# Altium schematic sheet POGO_Tester_Rev1_Connectors.SchDoc
size OrCAD B; SheetNumber: 2; SheetTotal: 2
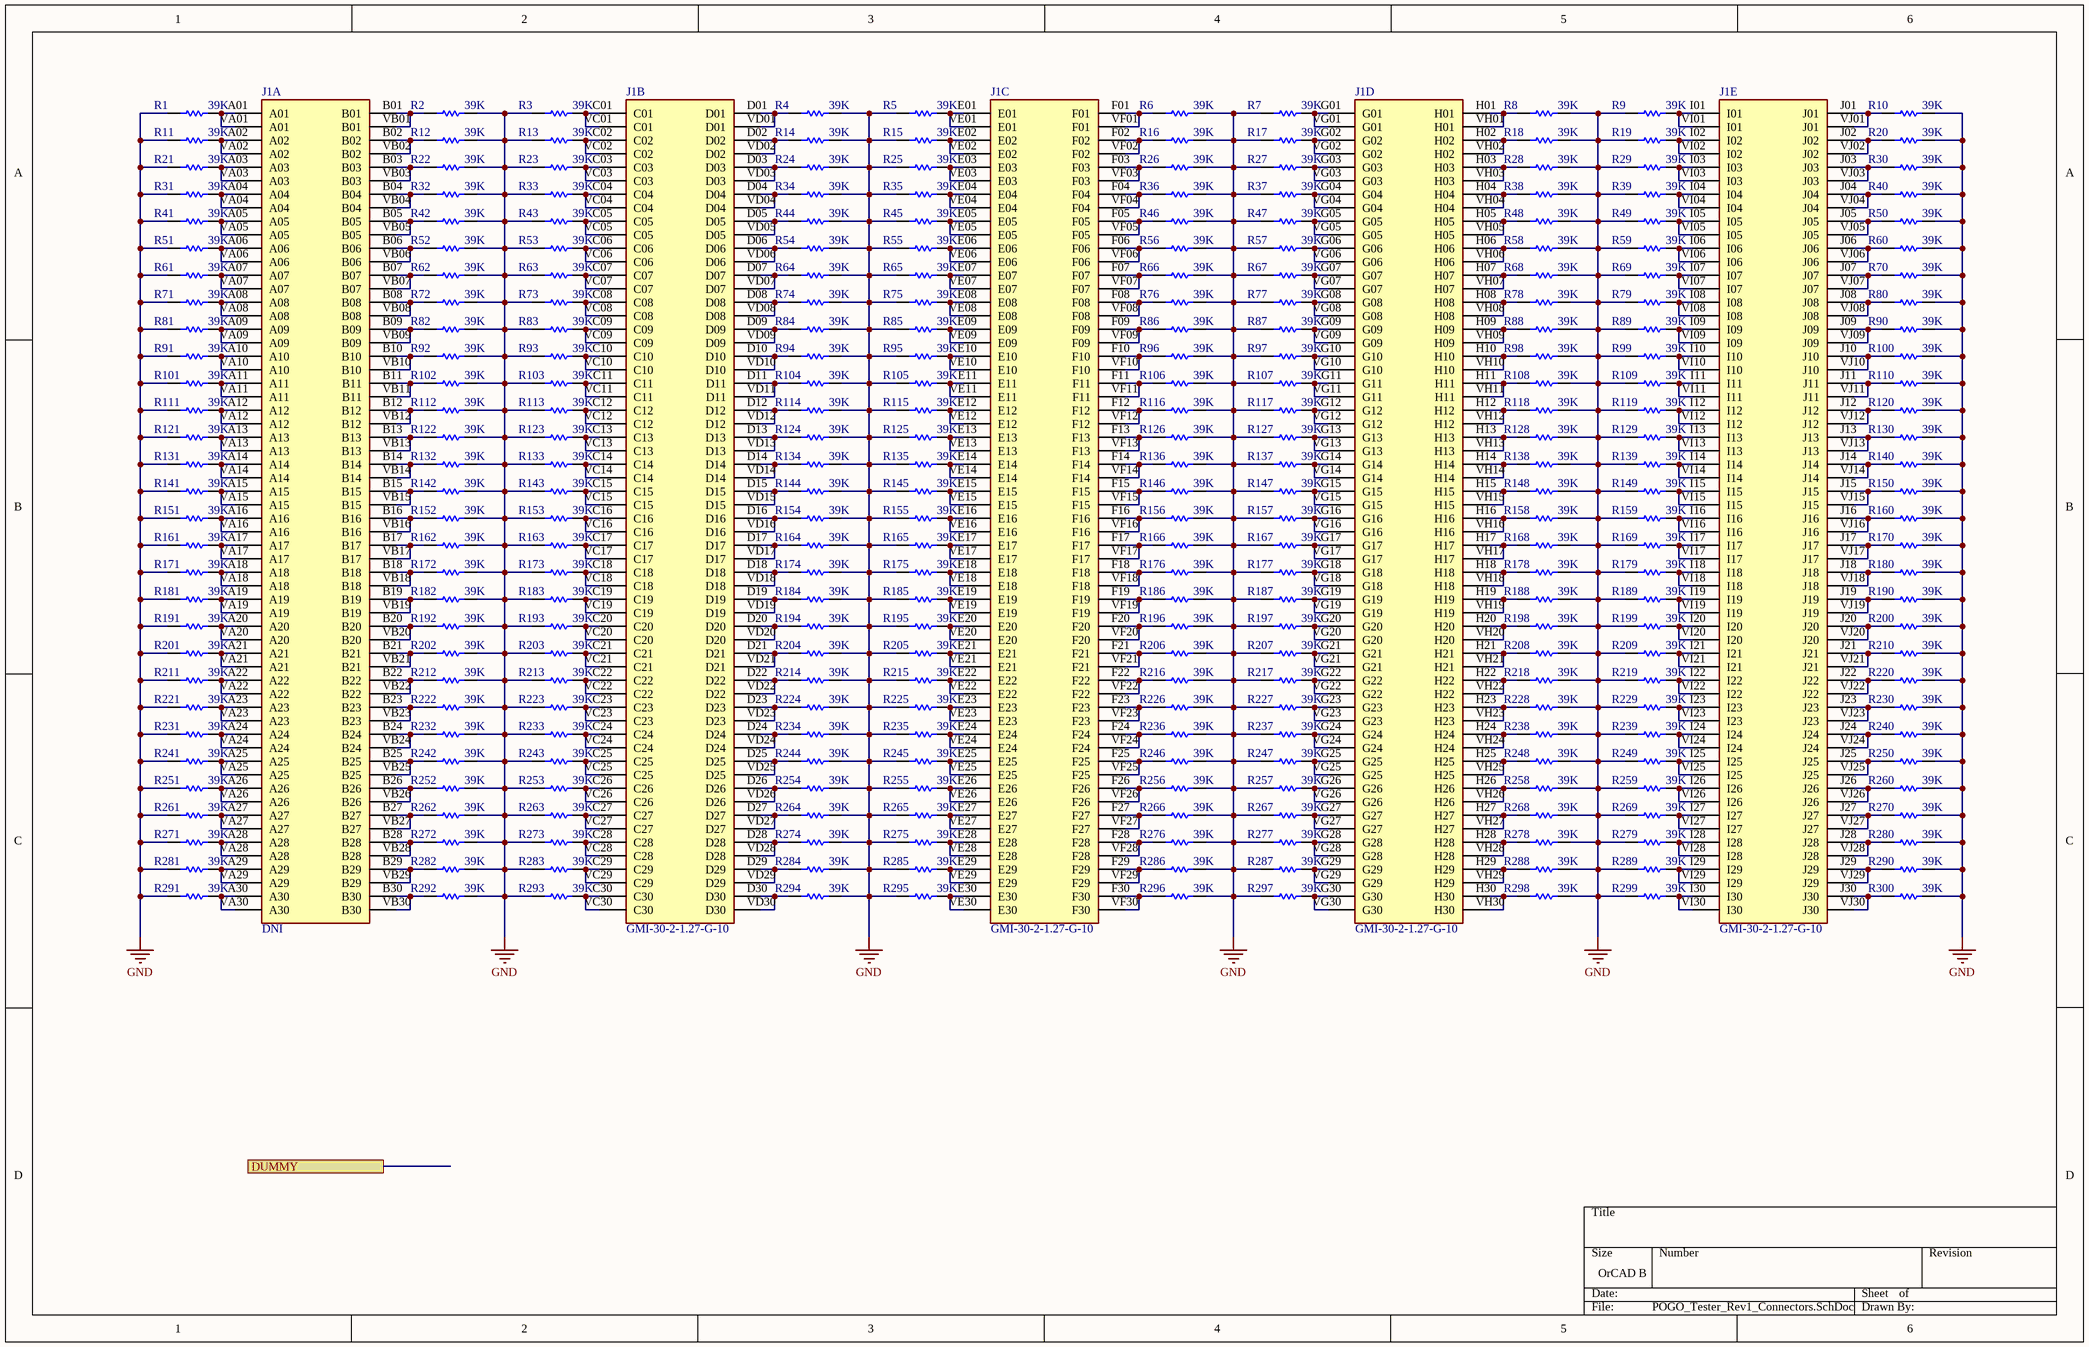
[diagram p0: POGO_Tester_Rev1_Connectors.SchDoc]

## Parts
J1  DNI  [SAMTEC_GMI-30-2-1.27-G-10 - Nothing But Pads]  (parts A,B,C,D,E of 5)
R1  value 39K  [DEFAULT_RESISTOR_0402]  (hidden comment: RCS040239K0FKED)
R2  value 39K  [DEFAULT_RESISTOR_0402]  (hidden comment: RCS040239K0FKED)
R3  value 39K  [DEFAULT_RESISTOR_0402]  (hidden comment: RCS040239K0FKED)
R4  value 39K  [DEFAULT_RESISTOR_0402]  (hidden comment: RCS040239K0FKED)
R5  value 39K  [DEFAULT_RESISTOR_0402]  (hidden comment: RCS040239K0FKED)
R6  value 39K  [DEFAULT_RESISTOR_0402]  (hidden comment: RCS040239K0FKED)
R7  value 39K  [DEFAULT_RESISTOR_0402]  (hidden comment: RCS040239K0FKED)
R8  value 39K  [DEFAULT_RESISTOR_0402]  (hidden comment: RCS040239K0FKED)
R9  value 39K  [DEFAULT_RESISTOR_0402]  (hidden comment: RCS040239K0FKED)
R10  value 39K  [DEFAULT_RESISTOR_0402]  (hidden comment: RCS040239K0FKED)
R11  value 39K  [DEFAULT_RESISTOR_0402]  (hidden comment: RCS040239K0FKED)
R12  value 39K  [DEFAULT_RESISTOR_0402]  (hidden comment: RCS040239K0FKED)
R13  value 39K  [DEFAULT_RESISTOR_0402]  (hidden comment: RCS040239K0FKED)
R14  value 39K  [DEFAULT_RESISTOR_0402]  (hidden comment: RCS040239K0FKED)
R15  value 39K  [DEFAULT_RESISTOR_0402]  (hidden comment: RCS040239K0FKED)
R16  value 39K  [DEFAULT_RESISTOR_0402]  (hidden comment: RCS040239K0FKED)
R17  value 39K  [DEFAULT_RESISTOR_0402]  (hidden comment: RCS040239K0FKED)
R18  value 39K  [DEFAULT_RESISTOR_0402]  (hidden comment: RCS040239K0FKED)
R19  value 39K  [DEFAULT_RESISTOR_0402]  (hidden comment: RCS040239K0FKED)
R20  value 39K  [DEFAULT_RESISTOR_0402]  (hidden comment: RCS040239K0FKED)
R21  value 39K  [DEFAULT_RESISTOR_0402]  (hidden comment: RCS040239K0FKED)
R22  value 39K  [DEFAULT_RESISTOR_0402]  (hidden comment: RCS040239K0FKED)
R23  value 39K  [DEFAULT_RESISTOR_0402]  (hidden comment: RCS040239K0FKED)
R24  value 39K  [DEFAULT_RESISTOR_0402]  (hidden comment: RCS040239K0FKED)
R25  value 39K  [DEFAULT_RESISTOR_0402]  (hidden comment: RCS040239K0FKED)
R26  value 39K  [DEFAULT_RESISTOR_0402]  (hidden comment: RCS040239K0FKED)
R27  value 39K  [DEFAULT_RESISTOR_0402]  (hidden comment: RCS040239K0FKED)
R28  value 39K  [DEFAULT_RESISTOR_0402]  (hidden comment: RCS040239K0FKED)
R29  value 39K  [DEFAULT_RESISTOR_0402]  (hidden comment: RCS040239K0FKED)
R30  value 39K  [DEFAULT_RESISTOR_0402]  (hidden comment: RCS040239K0FKED)
R31  value 39K  [DEFAULT_RESISTOR_0402]  (hidden comment: RCS040239K0FKED)
R32  value 39K  [DEFAULT_RESISTOR_0402]  (hidden comment: RCS040239K0FKED)
R33  value 39K  [DEFAULT_RESISTOR_0402]  (hidden comment: RCS040239K0FKED)
R34  value 39K  [DEFAULT_RESISTOR_0402]  (hidden comment: RCS040239K0FKED)
R35  value 39K  [DEFAULT_RESISTOR_0402]  (hidden comment: RCS040239K0FKED)
R36  value 39K  [DEFAULT_RESISTOR_0402]  (hidden comment: RCS040239K0FKED)
R37  value 39K  [DEFAULT_RESISTOR_0402]  (hidden comment: RCS040239K0FKED)
R38  value 39K  [DEFAULT_RESISTOR_0402]  (hidden comment: RCS040239K0FKED)
R39  value 39K  [DEFAULT_RESISTOR_0402]  (hidden comment: RCS040239K0FKED)
R40  value 39K  [DEFAULT_RESISTOR_0402]  (hidden comment: RCS040239K0FKED)
R41  value 39K  [DEFAULT_RESISTOR_0402]  (hidden comment: RCS040239K0FKED)
R42  value 39K  [DEFAULT_RESISTOR_0402]  (hidden comment: RCS040239K0FKED)
R43  value 39K  [DEFAULT_RESISTOR_0402]  (hidden comment: RCS040239K0FKED)
R44  value 39K  [DEFAULT_RESISTOR_0402]  (hidden comment: RCS040239K0FKED)
R45  value 39K  [DEFAULT_RESISTOR_0402]  (hidden comment: RCS040239K0FKED)
R46  value 39K  [DEFAULT_RESISTOR_0402]  (hidden comment: RCS040239K0FKED)
R47  value 39K  [DEFAULT_RESISTOR_0402]  (hidden comment: RCS040239K0FKED)
R48  value 39K  [DEFAULT_RESISTOR_0402]  (hidden comment: RCS040239K0FKED)
R49  value 39K  [DEFAULT_RESISTOR_0402]  (hidden comment: RCS040239K0FKED)
R50  value 39K  [DEFAULT_RESISTOR_0402]  (hidden comment: RCS040239K0FKED)
R51  value 39K  [DEFAULT_RESISTOR_0402]  (hidden comment: RCS040239K0FKED)
R52  value 39K  [DEFAULT_RESISTOR_0402]  (hidden comment: RCS040239K0FKED)
R53  value 39K  [DEFAULT_RESISTOR_0402]  (hidden comment: RCS040239K0FKED)
R54  value 39K  [DEFAULT_RESISTOR_0402]  (hidden comment: RCS040239K0FKED)
R55  value 39K  [DEFAULT_RESISTOR_0402]  (hidden comment: RCS040239K0FKED)
R56  value 39K  [DEFAULT_RESISTOR_0402]  (hidden comment: RCS040239K0FKED)
R57  value 39K  [DEFAULT_RESISTOR_0402]  (hidden comment: RCS040239K0FKED)
R58  value 39K  [DEFAULT_RESISTOR_0402]  (hidden comment: RCS040239K0FKED)
R59  value 39K  [DEFAULT_RESISTOR_0402]  (hidden comment: RCS040239K0FKED)
R60  value 39K  [DEFAULT_RESISTOR_0402]  (hidden comment: RCS040239K0FKED)
R61  value 39K  [DEFAULT_RESISTOR_0402]  (hidden comment: RCS040239K0FKED)
R62  value 39K  [DEFAULT_RESISTOR_0402]  (hidden comment: RCS040239K0FKED)
R63  value 39K  [DEFAULT_RESISTOR_0402]  (hidden comment: RCS040239K0FKED)
R64  value 39K  [DEFAULT_RESISTOR_0402]  (hidden comment: RCS040239K0FKED)
R65  value 39K  [DEFAULT_RESISTOR_0402]  (hidden comment: RCS040239K0FKED)
R66  value 39K  [DEFAULT_RESISTOR_0402]  (hidden comment: RCS040239K0FKED)
R67  value 39K  [DEFAULT_RESISTOR_0402]  (hidden comment: RCS040239K0FKED)
R68  value 39K  [DEFAULT_RESISTOR_0402]  (hidden comment: RCS040239K0FKED)
R69  value 39K  [DEFAULT_RESISTOR_0402]  (hidden comment: RCS040239K0FKED)
R70  value 39K  [DEFAULT_RESISTOR_0402]  (hidden comment: RCS040239K0FKED)
R71  value 39K  [DEFAULT_RESISTOR_0402]  (hidden comment: RCS040239K0FKED)
R72  value 39K  [DEFAULT_RESISTOR_0402]  (hidden comment: RCS040239K0FKED)
R73  value 39K  [DEFAULT_RESISTOR_0402]  (hidden comment: RCS040239K0FKED)
R74  value 39K  [DEFAULT_RESISTOR_0402]  (hidden comment: RCS040239K0FKED)
R75  value 39K  [DEFAULT_RESISTOR_0402]  (hidden comment: RCS040239K0FKED)
R76  value 39K  [DEFAULT_RESISTOR_0402]  (hidden comment: RCS040239K0FKED)
R77  value 39K  [DEFAULT_RESISTOR_0402]  (hidden comment: RCS040239K0FKED)
R78  value 39K  [DEFAULT_RESISTOR_0402]  (hidden comment: RCS040239K0FKED)
R79  value 39K  [DEFAULT_RESISTOR_0402]  (hidden comment: RCS040239K0FKED)
R80  value 39K  [DEFAULT_RESISTOR_0402]  (hidden comment: RCS040239K0FKED)
R81  value 39K  [DEFAULT_RESISTOR_0402]  (hidden comment: RCS040239K0FKED)
R82  value 39K  [DEFAULT_RESISTOR_0402]  (hidden comment: RCS040239K0FKED)
R83  value 39K  [DEFAULT_RESISTOR_0402]  (hidden comment: RCS040239K0FKED)
R84  value 39K  [DEFAULT_RESISTOR_0402]  (hidden comment: RCS040239K0FKED)
R85  value 39K  [DEFAULT_RESISTOR_0402]  (hidden comment: RCS040239K0FKED)
R86  value 39K  [DEFAULT_RESISTOR_0402]  (hidden comment: RCS040239K0FKED)
R87  value 39K  [DEFAULT_RESISTOR_0402]  (hidden comment: RCS040239K0FKED)
R88  value 39K  [DEFAULT_RESISTOR_0402]  (hidden comment: RCS040239K0FKED)
R89  value 39K  [DEFAULT_RESISTOR_0402]  (hidden comment: RCS040239K0FKED)
R90  value 39K  [DEFAULT_RESISTOR_0402]  (hidden comment: RCS040239K0FKED)
R91  value 39K  [DEFAULT_RESISTOR_0402]  (hidden comment: RCS040239K0FKED)
R92  value 39K  [DEFAULT_RESISTOR_0402]  (hidden comment: RCS040239K0FKED)
R93  value 39K  [DEFAULT_RESISTOR_0402]  (hidden comment: RCS040239K0FKED)
R94  value 39K  [DEFAULT_RESISTOR_0402]  (hidden comment: RCS040239K0FKED)
R95  value 39K  [DEFAULT_RESISTOR_0402]  (hidden comment: RCS040239K0FKED)
R96  value 39K  [DEFAULT_RESISTOR_0402]  (hidden comment: RCS040239K0FKED)
R97  value 39K  [DEFAULT_RESISTOR_0402]  (hidden comment: RCS040239K0FKED)
R98  value 39K  [DEFAULT_RESISTOR_0402]  (hidden comment: RCS040239K0FKED)
R99  value 39K  [DEFAULT_RESISTOR_0402]  (hidden comment: RCS040239K0FKED)
R100  value 39K  [DEFAULT_RESISTOR_0402]  (hidden comment: RCS040239K0FKED)
R101  value 39K  [DEFAULT_RESISTOR_0402]  (hidden comment: RCS040239K0FKED)
R102  value 39K  [DEFAULT_RESISTOR_0402]  (hidden comment: RCS040239K0FKED)
R103  value 39K  [DEFAULT_RESISTOR_0402]  (hidden comment: RCS040239K0FKED)
R104  value 39K  [DEFAULT_RESISTOR_0402]  (hidden comment: RCS040239K0FKED)
R105  value 39K  [DEFAULT_RESISTOR_0402]  (hidden comment: RCS040239K0FKED)
R106  value 39K  [DEFAULT_RESISTOR_0402]  (hidden comment: RCS040239K0FKED)
R107  value 39K  [DEFAULT_RESISTOR_0402]  (hidden comment: RCS040239K0FKED)
R108  value 39K  [DEFAULT_RESISTOR_0402]  (hidden comment: RCS040239K0FKED)
R109  value 39K  [DEFAULT_RESISTOR_0402]  (hidden comment: RCS040239K0FKED)
R110  value 39K  [DEFAULT_RESISTOR_0402]  (hidden comment: RCS040239K0FKED)
R111  value 39K  [DEFAULT_RESISTOR_0402]  (hidden comment: RCS040239K0FKED)
R112  value 39K  [DEFAULT_RESISTOR_0402]  (hidden comment: RCS040239K0FKED)
R113  value 39K  [DEFAULT_RESISTOR_0402]  (hidden comment: RCS040239K0FKED)
R114  value 39K  [DEFAULT_RESISTOR_0402]  (hidden comment: RCS040239K0FKED)
R115  value 39K  [DEFAULT_RESISTOR_0402]  (hidden comment: RCS040239K0FKED)
R116  value 39K  [DEFAULT_RESISTOR_0402]  (hidden comment: RCS040239K0FKED)
R117  value 39K  [DEFAULT_RESISTOR_0402]  (hidden comment: RCS040239K0FKED)
R118  value 39K  [DEFAULT_RESISTOR_0402]  (hidden comment: RCS040239K0FKED)
R119  value 39K  [DEFAULT_RESISTOR_0402]  (hidden comment: RCS040239K0FKED)
R120  value 39K  [DEFAULT_RESISTOR_0402]  (hidden comment: RCS040239K0FKED)
R121  value 39K  [DEFAULT_RESISTOR_0402]  (hidden comment: RCS040239K0FKED)
R122  value 39K  [DEFAULT_RESISTOR_0402]  (hidden comment: RCS040239K0FKED)
R123  value 39K  [DEFAULT_RESISTOR_0402]  (hidden comment: RCS040239K0FKED)
R124  value 39K  [DEFAULT_RESISTOR_0402]  (hidden comment: RCS040239K0FKED)
R125  value 39K  [DEFAULT_RESISTOR_0402]  (hidden comment: RCS040239K0FKED)
R126  value 39K  [DEFAULT_RESISTOR_0402]  (hidden comment: RCS040239K0FKED)
R127  value 39K  [DEFAULT_RESISTOR_0402]  (hidden comment: RCS040239K0FKED)
R128  value 39K  [DEFAULT_RESISTOR_0402]  (hidden comment: RCS040239K0FKED)
R129  value 39K  [DEFAULT_RESISTOR_0402]  (hidden comment: RCS040239K0FKED)
R130  value 39K  [DEFAULT_RESISTOR_0402]  (hidden comment: RCS040239K0FKED)
R131  value 39K  [DEFAULT_RESISTOR_0402]  (hidden comment: RCS040239K0FKED)
R132  value 39K  [DEFAULT_RESISTOR_0402]  (hidden comment: RCS040239K0FKED)
R133  value 39K  [DEFAULT_RESISTOR_0402]  (hidden comment: RCS040239K0FKED)
R134  value 39K  [DEFAULT_RESISTOR_0402]  (hidden comment: RCS040239K0FKED)
R135  value 39K  [DEFAULT_RESISTOR_0402]  (hidden comment: RCS040239K0FKED)
R136  value 39K  [DEFAULT_RESISTOR_0402]  (hidden comment: RCS040239K0FKED)
R137  value 39K  [DEFAULT_RESISTOR_0402]  (hidden comment: RCS040239K0FKED)
R138  value 39K  [DEFAULT_RESISTOR_0402]  (hidden comment: RCS040239K0FKED)
R139  value 39K  [DEFAULT_RESISTOR_0402]  (hidden comment: RCS040239K0FKED)
R140  value 39K  [DEFAULT_RESISTOR_0402]  (hidden comment: RCS040239K0FKED)
R141  value 39K  [DEFAULT_RESISTOR_0402]  (hidden comment: RCS040239K0FKED)
R142  value 39K  [DEFAULT_RESISTOR_0402]  (hidden comment: RCS040239K0FKED)
R143  value 39K  [DEFAULT_RESISTOR_0402]  (hidden comment: RCS040239K0FKED)
R144  value 39K  [DEFAULT_RESISTOR_0402]  (hidden comment: RCS040239K0FKED)
R145  value 39K  [DEFAULT_RESISTOR_0402]  (hidden comment: RCS040239K0FKED)
R146  value 39K  [DEFAULT_RESISTOR_0402]  (hidden comment: RCS040239K0FKED)
R147  value 39K  [DEFAULT_RESISTOR_0402]  (hidden comment: RCS040239K0FKED)
R148  value 39K  [DEFAULT_RESISTOR_0402]  (hidden comment: RCS040239K0FKED)
R149  value 39K  [DEFAULT_RESISTOR_0402]  (hidden comment: RCS040239K0FKED)
R150  value 39K  [DEFAULT_RESISTOR_0402]  (hidden comment: RCS040239K0FKED)
R151  value 39K  [DEFAULT_RESISTOR_0402]  (hidden comment: RCS040239K0FKED)
R152  value 39K  [DEFAULT_RESISTOR_0402]  (hidden comment: RCS040239K0FKED)
R153  value 39K  [DEFAULT_RESISTOR_0402]  (hidden comment: RCS040239K0FKED)
R154  value 39K  [DEFAULT_RESISTOR_0402]  (hidden comment: RCS040239K0FKED)
R155  value 39K  [DEFAULT_RESISTOR_0402]  (hidden comment: RCS040239K0FKED)
R156  value 39K  [DEFAULT_RESISTOR_0402]  (hidden comment: RCS040239K0FKED)
R157  value 39K  [DEFAULT_RESISTOR_0402]  (hidden comment: RCS040239K0FKED)
R158  value 39K  [DEFAULT_RESISTOR_0402]  (hidden comment: RCS040239K0FKED)
R159  value 39K  [DEFAULT_RESISTOR_0402]  (hidden comment: RCS040239K0FKED)
R160  value 39K  [DEFAULT_RESISTOR_0402]  (hidden comment: RCS040239K0FKED)
R161  value 39K  [DEFAULT_RESISTOR_0402]  (hidden comment: RCS040239K0FKED)
R162  value 39K  [DEFAULT_RESISTOR_0402]  (hidden comment: RCS040239K0FKED)
R163  value 39K  [DEFAULT_RESISTOR_0402]  (hidden comment: RCS040239K0FKED)
R164  value 39K  [DEFAULT_RESISTOR_0402]  (hidden comment: RCS040239K0FKED)
R165  value 39K  [DEFAULT_RESISTOR_0402]  (hidden comment: RCS040239K0FKED)
R166  value 39K  [DEFAULT_RESISTOR_0402]  (hidden comment: RCS040239K0FKED)
R167  value 39K  [DEFAULT_RESISTOR_0402]  (hidden comment: RCS040239K0FKED)
R168  value 39K  [DEFAULT_RESISTOR_0402]  (hidden comment: RCS040239K0FKED)
R169  value 39K  [DEFAULT_RESISTOR_0402]  (hidden comment: RCS040239K0FKED)
R170  value 39K  [DEFAULT_RESISTOR_0402]  (hidden comment: RCS040239K0FKED)
R171  value 39K  [DEFAULT_RESISTOR_0402]  (hidden comment: RCS040239K0FKED)
R172  value 39K  [DEFAULT_RESISTOR_0402]  (hidden comment: RCS040239K0FKED)
R173  value 39K  [DEFAULT_RESISTOR_0402]  (hidden comment: RCS040239K0FKED)
R174  value 39K  [DEFAULT_RESISTOR_0402]  (hidden comment: RCS040239K0FKED)
R175  value 39K  [DEFAULT_RESISTOR_0402]  (hidden comment: RCS040239K0FKED)
R176  value 39K  [DEFAULT_RESISTOR_0402]  (hidden comment: RCS040239K0FKED)
R177  value 39K  [DEFAULT_RESISTOR_0402]  (hidden comment: RCS040239K0FKED)
R178  value 39K  [DEFAULT_RESISTOR_0402]  (hidden comment: RCS040239K0FKED)
R179  value 39K  [DEFAULT_RESISTOR_0402]  (hidden comment: RCS040239K0FKED)
R180  value 39K  [DEFAULT_RESISTOR_0402]  (hidden comment: RCS040239K0FKED)
R181  value 39K  [DEFAULT_RESISTOR_0402]  (hidden comment: RCS040239K0FKED)
R182  value 39K  [DEFAULT_RESISTOR_0402]  (hidden comment: RCS040239K0FKED)
R183  value 39K  [DEFAULT_RESISTOR_0402]  (hidden comment: RCS040239K0FKED)
R184  value 39K  [DEFAULT_RESISTOR_0402]  (hidden comment: RCS040239K0FKED)
R185  value 39K  [DEFAULT_RESISTOR_0402]  (hidden comment: RCS040239K0FKED)
R186  value 39K  [DEFAULT_RESISTOR_0402]  (hidden comment: RCS040239K0FKED)
R187  value 39K  [DEFAULT_RESISTOR_0402]  (hidden comment: RCS040239K0FKED)
R188  value 39K  [DEFAULT_RESISTOR_0402]  (hidden comment: RCS040239K0FKED)
R189  value 39K  [DEFAULT_RESISTOR_0402]  (hidden comment: RCS040239K0FKED)
R190  value 39K  [DEFAULT_RESISTOR_0402]  (hidden comment: RCS040239K0FKED)
R191  value 39K  [DEFAULT_RESISTOR_0402]  (hidden comment: RCS040239K0FKED)
R192  value 39K  [DEFAULT_RESISTOR_0402]  (hidden comment: RCS040239K0FKED)
R193  value 39K  [DEFAULT_RESISTOR_0402]  (hidden comment: RCS040239K0FKED)
R194  value 39K  [DEFAULT_RESISTOR_0402]  (hidden comment: RCS040239K0FKED)
R195  value 39K  [DEFAULT_RESISTOR_0402]  (hidden comment: RCS040239K0FKED)
R196  value 39K  [DEFAULT_RESISTOR_0402]  (hidden comment: RCS040239K0FKED)
R197  value 39K  [DEFAULT_RESISTOR_0402]  (hidden comment: RCS040239K0FKED)
R198  value 39K  [DEFAULT_RESISTOR_0402]  (hidden comment: RCS040239K0FKED)
R199  value 39K  [DEFAULT_RESISTOR_0402]  (hidden comment: RCS040239K0FKED)
R200  value 39K  [DEFAULT_RESISTOR_0402]  (hidden comment: RCS040239K0FKED)
R201  value 39K  [DEFAULT_RESISTOR_0402]  (hidden comment: RCS040239K0FKED)
R202  value 39K  [DEFAULT_RESISTOR_0402]  (hidden comment: RCS040239K0FKED)
R203  value 39K  [DEFAULT_RESISTOR_0402]  (hidden comment: RCS040239K0FKED)
R204  value 39K  [DEFAULT_RESISTOR_0402]  (hidden comment: RCS040239K0FKED)
R205  value 39K  [DEFAULT_RESISTOR_0402]  (hidden comment: RCS040239K0FKED)
R206  value 39K  [DEFAULT_RESISTOR_0402]  (hidden comment: RCS040239K0FKED)
R207  value 39K  [DEFAULT_RESISTOR_0402]  (hidden comment: RCS040239K0FKED)
R208  value 39K  [DEFAULT_RESISTOR_0402]  (hidden comment: RCS040239K0FKED)
R209  value 39K  [DEFAULT_RESISTOR_0402]  (hidden comment: RCS040239K0FKED)
R210  value 39K  [DEFAULT_RESISTOR_0402]  (hidden comment: RCS040239K0FKED)
R211  value 39K  [DEFAULT_RESISTOR_0402]  (hidden comment: RCS040239K0FKED)
R212  value 39K  [DEFAULT_RESISTOR_0402]  (hidden comment: RCS040239K0FKED)
R213  value 39K  [DEFAULT_RESISTOR_0402]  (hidden comment: RCS040239K0FKED)
R214  value 39K  [DEFAULT_RESISTOR_0402]  (hidden comment: RCS040239K0FKED)
R215  value 39K  [DEFAULT_RESISTOR_0402]  (hidden comment: RCS040239K0FKED)
R216  value 39K  [DEFAULT_RESISTOR_0402]  (hidden comment: RCS040239K0FKED)
R217  value 39K  [DEFAULT_RESISTOR_0402]  (hidden comment: RCS040239K0FKED)
R218  value 39K  [DEFAULT_RESISTOR_0402]  (hidden comment: RCS040239K0FKED)
R219  value 39K  [DEFAULT_RESISTOR_0402]  (hidden comment: RCS040239K0FKED)
R220  value 39K  [DEFAULT_RESISTOR_0402]  (hidden comment: RCS040239K0FKED)
R221  value 39K  [DEFAULT_RESISTOR_0402]  (hidden comment: RCS040239K0FKED)
R222  value 39K  [DEFAULT_RESISTOR_0402]  (hidden comment: RCS040239K0FKED)
R223  value 39K  [DEFAULT_RESISTOR_0402]  (hidden comment: RCS040239K0FKED)
R224  value 39K  [DEFAULT_RESISTOR_0402]  (hidden comment: RCS040239K0FKED)
R225  value 39K  [DEFAULT_RESISTOR_0402]  (hidden comment: RCS040239K0FKED)
R226  value 39K  [DEFAULT_RESISTOR_0402]  (hidden comment: RCS040239K0FKED)
R227  value 39K  [DEFAULT_RESISTOR_0402]  (hidden comment: RCS040239K0FKED)
R228  value 39K  [DEFAULT_RESISTOR_0402]  (hidden comment: RCS040239K0FKED)
R229  value 39K  [DEFAULT_RESISTOR_0402]  (hidden comment: RCS040239K0FKED)
R230  value 39K  [DEFAULT_RESISTOR_0402]  (hidden comment: RCS040239K0FKED)
R231  value 39K  [DEFAULT_RESISTOR_0402]  (hidden comment: RCS040239K0FKED)
R232  value 39K  [DEFAULT_RESISTOR_0402]  (hidden comment: RCS040239K0FKED)
R233  value 39K  [DEFAULT_RESISTOR_0402]  (hidden comment: RCS040239K0FKED)
R234  value 39K  [DEFAULT_RESISTOR_0402]  (hidden comment: RCS040239K0FKED)
R235  value 39K  [DEFAULT_RESISTOR_0402]  (hidden comment: RCS040239K0FKED)
R236  value 39K  [DEFAULT_RESISTOR_0402]  (hidden comment: RCS040239K0FKED)
R237  value 39K  [DEFAULT_RESISTOR_0402]  (hidden comment: RCS040239K0FKED)
R238  value 39K  [DEFAULT_RESISTOR_0402]  (hidden comment: RCS040239K0FKED)
R239  value 39K  [DEFAULT_RESISTOR_0402]  (hidden comment: RCS040239K0FKED)
R240  value 39K  [DEFAULT_RESISTOR_0402]  (hidden comment: RCS040239K0FKED)
R241  value 39K  [DEFAULT_RESISTOR_0402]  (hidden comment: RCS040239K0FKED)
R242  value 39K  [DEFAULT_RESISTOR_0402]  (hidden comment: RCS040239K0FKED)
R243  value 39K  [DEFAULT_RESISTOR_0402]  (hidden comment: RCS040239K0FKED)
R244  value 39K  [DEFAULT_RESISTOR_0402]  (hidden comment: RCS040239K0FKED)
R245  value 39K  [DEFAULT_RESISTOR_0402]  (hidden comment: RCS040239K0FKED)
R246  value 39K  [DEFAULT_RESISTOR_0402]  (hidden comment: RCS040239K0FKED)
R247  value 39K  [DEFAULT_RESISTOR_0402]  (hidden comment: RCS040239K0FKED)
R248  value 39K  [DEFAULT_RESISTOR_0402]  (hidden comment: RCS040239K0FKED)
R249  value 39K  [DEFAULT_RESISTOR_0402]  (hidden comment: RCS040239K0FKED)
R250  value 39K  [DEFAULT_RESISTOR_0402]  (hidden comment: RCS040239K0FKED)
R251  value 39K  [DEFAULT_RESISTOR_0402]  (hidden comment: RCS040239K0FKED)
R252  value 39K  [DEFAULT_RESISTOR_0402]  (hidden comment: RCS040239K0FKED)
R253  value 39K  [DEFAULT_RESISTOR_0402]  (hidden comment: RCS040239K0FKED)
R254  value 39K  [DEFAULT_RESISTOR_0402]  (hidden comment: RCS040239K0FKED)
R255  value 39K  [DEFAULT_RESISTOR_0402]  (hidden comment: RCS040239K0FKED)
R256  value 39K  [DEFAULT_RESISTOR_0402]  (hidden comment: RCS040239K0FKED)
R257  value 39K  [DEFAULT_RESISTOR_0402]  (hidden comment: RCS040239K0FKED)
R258  value 39K  [DEFAULT_RESISTOR_0402]  (hidden comment: RCS040239K0FKED)
R259  value 39K  [DEFAULT_RESISTOR_0402]  (hidden comment: RCS040239K0FKED)
R260  value 39K  [DEFAULT_RESISTOR_0402]  (hidden comment: RCS040239K0FKED)
R261  value 39K  [DEFAULT_RESISTOR_0402]  (hidden comment: RCS040239K0FKED)
R262  value 39K  [DEFAULT_RESISTOR_0402]  (hidden comment: RCS040239K0FKED)
R263  value 39K  [DEFAULT_RESISTOR_0402]  (hidden comment: RCS040239K0FKED)
R264  value 39K  [DEFAULT_RESISTOR_0402]  (hidden comment: RCS040239K0FKED)
R265  value 39K  [DEFAULT_RESISTOR_0402]  (hidden comment: RCS040239K0FKED)
R266  value 39K  [DEFAULT_RESISTOR_0402]  (hidden comment: RCS040239K0FKED)
R267  value 39K  [DEFAULT_RESISTOR_0402]  (hidden comment: RCS040239K0FKED)
R268  value 39K  [DEFAULT_RESISTOR_0402]  (hidden comment: RCS040239K0FKED)
R269  value 39K  [DEFAULT_RESISTOR_0402]  (hidden comment: RCS040239K0FKED)
R270  value 39K  [DEFAULT_RESISTOR_0402]  (hidden comment: RCS040239K0FKED)
R271  value 39K  [DEFAULT_RESISTOR_0402]  (hidden comment: RCS040239K0FKED)
R272  value 39K  [DEFAULT_RESISTOR_0402]  (hidden comment: RCS040239K0FKED)
R273  value 39K  [DEFAULT_RESISTOR_0402]  (hidden comment: RCS040239K0FKED)
R274  value 39K  [DEFAULT_RESISTOR_0402]  (hidden comment: RCS040239K0FKED)
R275  value 39K  [DEFAULT_RESISTOR_0402]  (hidden comment: RCS040239K0FKED)
R276  value 39K  [DEFAULT_RESISTOR_0402]  (hidden comment: RCS040239K0FKED)
R277  value 39K  [DEFAULT_RESISTOR_0402]  (hidden comment: RCS040239K0FKED)
R278  value 39K  [DEFAULT_RESISTOR_0402]  (hidden comment: RCS040239K0FKED)
R279  value 39K  [DEFAULT_RESISTOR_0402]  (hidden comment: RCS040239K0FKED)
R280  value 39K  [DEFAULT_RESISTOR_0402]  (hidden comment: RCS040239K0FKED)
R281  value 39K  [DEFAULT_RESISTOR_0402]  (hidden comment: RCS040239K0FKED)
R282  value 39K  [DEFAULT_RESISTOR_0402]  (hidden comment: RCS040239K0FKED)
R283  value 39K  [DEFAULT_RESISTOR_0402]  (hidden comment: RCS040239K0FKED)
R284  value 39K  [DEFAULT_RESISTOR_0402]  (hidden comment: RCS040239K0FKED)
R285  value 39K  [DEFAULT_RESISTOR_0402]  (hidden comment: RCS040239K0FKED)
R286  value 39K  [DEFAULT_RESISTOR_0402]  (hidden comment: RCS040239K0FKED)
R287  value 39K  [DEFAULT_RESISTOR_0402]  (hidden comment: RCS040239K0FKED)
R288  value 39K  [DEFAULT_RESISTOR_0402]  (hidden comment: RCS040239K0FKED)
R289  value 39K  [DEFAULT_RESISTOR_0402]  (hidden comment: RCS040239K0FKED)
R290  value 39K  [DEFAULT_RESISTOR_0402]  (hidden comment: RCS040239K0FKED)
R291  value 39K  [DEFAULT_RESISTOR_0402]  (hidden comment: RCS040239K0FKED)
R292  value 39K  [DEFAULT_RESISTOR_0402]  (hidden comment: RCS040239K0FKED)
R293  value 39K  [DEFAULT_RESISTOR_0402]  (hidden comment: RCS040239K0FKED)
R294  value 39K  [DEFAULT_RESISTOR_0402]  (hidden comment: RCS040239K0FKED)
R295  value 39K  [DEFAULT_RESISTOR_0402]  (hidden comment: RCS040239K0FKED)
R296  value 39K  [DEFAULT_RESISTOR_0402]  (hidden comment: RCS040239K0FKED)
R297  value 39K  [DEFAULT_RESISTOR_0402]  (hidden comment: RCS040239K0FKED)
R298  value 39K  [DEFAULT_RESISTOR_0402]  (hidden comment: RCS040239K0FKED)
R299  value 39K  [DEFAULT_RESISTOR_0402]  (hidden comment: RCS040239K0FKED)
R300  value 39K  [DEFAULT_RESISTOR_0402]  (hidden comment: RCS040239K0FKED)

## Ports
DUMMY

## Nets
GND: R1.2 R2.1 R3.2 R4.1 R5.2 R6.1 R7.2 R8.1 R9.2 R10.1 R11.2 R12.1 R13.2 R14.1 R15.2 R16.1 R17.2 R18.1 R19.2 R20.1 R21.2 R22.1 R23.2 R24.1 R25.2 R26.1 R27.2 R28.1 R29.2 R30.1 R31.2 R32.1 R33.2 R34.1 R35.2 R36.1 R37.2 R38.1 R39.2 R40.1 R41.2 R42.1 R43.2 R44.1 R45.2 R46.1 R47.2 R48.1 R49.2 R50.1 R51.2 R52.1 R53.2 R54.1 R55.2 R56.1 R57.2 R58.1 R59.2 R60.1 R61.2 R62.1 R63.2 R64.1 R65.2 R66.1 R67.2 R68.1 R69.2 R70.1 R71.2 R72.1 R73.2 R74.1 R75.2 R76.1 R77.2 R78.1 R79.2 R80.1 R81.2 R82.1 R83.2 R84.1 R85.2 R86.1 R87.2 R88.1 R89.2 R90.1 R91.2 R92.1 R93.2 R94.1 R95.2 R96.1 R97.2 R98.1 R99.2 R100.1 R101.2 R102.1 R103.2 R104.1 R105.2 R106.1 R107.2 R108.1 R109.2 R110.1 R111.2 R112.1 R113.2 R114.1 R115.2 R116.1 R117.2 R118.1 R119.2 R120.1 R121.2 R122.1 R123.2 R124.1 R125.2 R126.1 R127.2 R128.1 R129.2 R130.1 R131.2 R132.1 R133.2 R134.1 R135.2 R136.1 R137.2 R138.1 R139.2 R140.1 R141.2 R142.1 R143.2 R144.1 R145.2 R146.1 R147.2 R148.1 R149.2 R150.1 R151.2 R152.1 R153.2 R154.1 R155.2 R156.1 R157.2 R158.1 R159.2 R160.1 R161.2 R162.1 R163.2 R164.1 R165.2 R166.1 R167.2 R168.1 R169.2 R170.1 R171.2 R172.1 R173.2 R174.1 R175.2 R176.1 R177.2 R178.1 R179.2 R180.1 R181.2 R182.1 R183.2 R184.1 R185.2 R186.1 R187.2 R188.1 R189.2 R190.1 R191.2 R192.1 R193.2 R194.1 R195.2 R196.1 R197.2 R198.1 R199.2 R200.1 R201.2 R202.1 R203.2 R204.1 R205.2 R206.1 R207.2 R208.1 R209.2 R210.1 R211.2 R212.1 R213.2 R214.1 R215.2 R216.1 R217.2 R218.1 R219.2 R220.1 R221.2 R222.1 R223.2 R224.1 R225.2 R226.1 R227.2 R228.1 R229.2 R230.1 R231.2 R232.1 R233.2 R234.1 R235.2 R236.1 R237.2 R238.1 R239.2 R240.1 R241.2 R242.1 R243.2 R244.1 R245.2 R246.1 R247.2 R248.1 R249.2 R250.1 R251.2 R252.1 R253.2 R254.1 R255.2 R256.1 R257.2 R258.1 R259.2 R260.1 R261.2 R262.1 R263.2 R264.1 R265.2 R266.1 R267.2 R268.1 R269.2 R270.1 R271.2 R272.1 R273.2 R274.1 R275.2 R276.1 R277.2 R278.1 R279.2 R280.1 R281.2 R282.1 R283.2 R284.1 R285.2 R286.1 R287.2 R288.1 R289.2 R290.1 R291.2 R292.1 R293.2 R294.1 R295.2 R296.1 R297.2 R298.1 R299.2 R300.1
NetJ1_A01: J1.A01 J1.VA01(A01) R1.1
NetJ1_A02: J1.A02 J1.VA02(A02) R11.1
NetJ1_A03: J1.A03 J1.VA03(A03) R21.1
NetJ1_A04: J1.A04 J1.VA04(A04) R31.1
NetJ1_A05: J1.A05 J1.VA05(A05) R41.1
NetJ1_A06: J1.A06 J1.VA06(A06) R51.1
NetJ1_A07: J1.A07 J1.VA07(A07) R61.1
NetJ1_A08: J1.A08 J1.VA08(A08) R71.1
NetJ1_A09: J1.A09 J1.VA09(A09) R81.1
NetJ1_A10: J1.A10 J1.VA10(A10) R91.1
NetJ1_A11: J1.A11 J1.VA11(A11) R101.1
NetJ1_A12: J1.A12 J1.VA12(A12) R111.1
NetJ1_A13: J1.A13 J1.VA13(A13) R121.1
NetJ1_A14: J1.A14 J1.VA14(A14) R131.1
NetJ1_A15: J1.A15 J1.VA15(A15) R141.1
NetJ1_A16: J1.A16 J1.VA16(A16) R151.1
NetJ1_A17: J1.A17 J1.VA17(A17) R161.1
NetJ1_A18: J1.A18 J1.VA18(A18) R171.1
NetJ1_A19: J1.A19 J1.VA19(A19) R181.1
NetJ1_A20: J1.A20 J1.VA20(A20) R191.1
NetJ1_A21: J1.A21 J1.VA21(A21) R201.1
NetJ1_A22: J1.A22 J1.VA22(A22) R211.1
NetJ1_A23: J1.A23 J1.VA23(A23) R221.1
NetJ1_A24: J1.A24 J1.VA24(A24) R231.1
NetJ1_A25: J1.A25 J1.VA25(A25) R241.1
NetJ1_A26: J1.A26 J1.VA26(A26) R251.1
NetJ1_A27: J1.A27 J1.VA27(A27) R261.1
NetJ1_A28: J1.A28 J1.VA28(A28) R271.1
NetJ1_A29: J1.A29 J1.VA29(A29) R281.1
NetJ1_A30: J1.A30 J1.VA30(A30) R291.1
NetJ1_B01: J1.B01 J1.VB01(B01) R2.2
NetJ1_B02: J1.B02 J1.VB02(B02) R12.2
NetJ1_B03: J1.B03 J1.VB03(B03) R22.2
NetJ1_B04: J1.B04 J1.VB04(B04) R32.2
NetJ1_B05: J1.B05 J1.VB05(B05) R42.2
NetJ1_B06: J1.B06 J1.VB06(B06) R52.2
NetJ1_B07: J1.B07 J1.VB07(B07) R62.2
NetJ1_B08: J1.B08 J1.VB08(B08) R72.2
NetJ1_B09: J1.B09 J1.VB09(B09) R82.2
NetJ1_B10: J1.B10 J1.VB10(B10) R92.2
NetJ1_B11: J1.B11 J1.VB11(B11) R102.2
NetJ1_B12: J1.B12 J1.VB12(B12) R112.2
NetJ1_B13: J1.B13 J1.VB13(B13) R122.2
NetJ1_B14: J1.B14 J1.VB14(B14) R132.2
NetJ1_B15: J1.B15 J1.VB15(B15) R142.2
NetJ1_B16: J1.B16 J1.VB16(B16) R152.2
NetJ1_B17: J1.B17 J1.VB17(B17) R162.2
NetJ1_B18: J1.B18 J1.VB18(B18) R172.2
NetJ1_B19: J1.B19 J1.VB19(B19) R182.2
NetJ1_B20: J1.B20 J1.VB20(B20) R192.2
NetJ1_B21: J1.B21 J1.VB21(B21) R202.2
NetJ1_B22: J1.B22 J1.VB22(B22) R212.2
NetJ1_B23: J1.B23 J1.VB23(B23) R222.2
NetJ1_B24: J1.B24 J1.VB24(B24) R232.2
NetJ1_B25: J1.B25 J1.VB25(B25) R242.2
NetJ1_B26: J1.B26 J1.VB26(B26) R252.2
NetJ1_B27: J1.B27 J1.VB27(B27) R262.2
NetJ1_B28: J1.B28 J1.VB28(B28) R272.2
NetJ1_B29: J1.B29 J1.VB29(B29) R282.2
NetJ1_B30: J1.B30 J1.VB30(B30) R292.2
NetJ1_C01: J1.C01 J1.VC01(C01) R3.1
NetJ1_C02: J1.C02 J1.VC02(C02) R13.1
NetJ1_C03: J1.C03 J1.VC03(C03) R23.1
NetJ1_C04: J1.C04 J1.VC04(C04) R33.1
NetJ1_C05: J1.C05 J1.VC05(C05) R43.1
NetJ1_C06: J1.C06 J1.VC06(C06) R53.1
NetJ1_C07: J1.C07 J1.VC07(C07) R63.1
NetJ1_C08: J1.C08 J1.VC08(C08) R73.1
NetJ1_C09: J1.C09 J1.VC09(C09) R83.1
NetJ1_C10: J1.C10 J1.VC10(C10) R93.1
NetJ1_C11: J1.C11 J1.VC11(C11) R103.1
NetJ1_C12: J1.C12 J1.VC12(C12) R113.1
NetJ1_C13: J1.C13 J1.VC13(C13) R123.1
NetJ1_C14: J1.C14 J1.VC14(C14) R133.1
NetJ1_C15: J1.C15 J1.VC15(C15) R143.1
NetJ1_C16: J1.C16 J1.VC16(C16) R153.1
NetJ1_C17: J1.C17 J1.VC17(C17) R163.1
NetJ1_C18: J1.C18 J1.VC18(C18) R173.1
NetJ1_C19: J1.C19 J1.VC19(C19) R183.1
NetJ1_C20: J1.C20 J1.VC20(C20) R193.1
NetJ1_C21: J1.C21 J1.VC21(C21) R203.1
NetJ1_C22: J1.C22 J1.VC22(C22) R213.1
NetJ1_C23: J1.C23 J1.VC23(C23) R223.1
NetJ1_C24: J1.C24 J1.VC24(C24) R233.1
NetJ1_C25: J1.C25 J1.VC25(C25) R243.1
NetJ1_C26: J1.C26 J1.VC26(C26) R253.1
NetJ1_C27: J1.C27 J1.VC27(C27) R263.1
NetJ1_C28: J1.C28 J1.VC28(C28) R273.1
NetJ1_C29: J1.C29 J1.VC29(C29) R283.1
NetJ1_C30: J1.C30 J1.VC30(C30) R293.1
NetJ1_D01: J1.D01 J1.VD01(D01) R4.2
NetJ1_D02: J1.D02 J1.VD02(D02) R14.2
NetJ1_D03: J1.D03 J1.VD03(D03) R24.2
NetJ1_D04: J1.D04 J1.VD04(D04) R34.2
NetJ1_D05: J1.D05 J1.VD05(D05) R44.2
NetJ1_D06: J1.D06 J1.VD06(D06) R54.2
NetJ1_D07: J1.D07 J1.VD07(D07) R64.2
NetJ1_D08: J1.D08 J1.VD08(D08) R74.2
NetJ1_D09: J1.D09 J1.VD09(D09) R84.2
NetJ1_D10: J1.D10 J1.VD10(D10) R94.2
NetJ1_D11: J1.D11 J1.VD11(D11) R104.2
NetJ1_D12: J1.D12 J1.VD12(D12) R114.2
NetJ1_D13: J1.D13 J1.VD13(D13) R124.2
NetJ1_D14: J1.D14 J1.VD14(D14) R134.2
NetJ1_D15: J1.D15 J1.VD15(D15) R144.2
NetJ1_D16: J1.D16 J1.VD16(D16) R154.2
NetJ1_D17: J1.D17 J1.VD17(D17) R164.2
NetJ1_D18: J1.D18 J1.VD18(D18) R174.2
NetJ1_D19: J1.D19 J1.VD19(D19) R184.2
NetJ1_D20: J1.D20 J1.VD20(D20) R194.2
NetJ1_D21: J1.D21 J1.VD21(D21) R204.2
NetJ1_D22: J1.D22 J1.VD22(D22) R214.2
NetJ1_D23: J1.D23 J1.VD23(D23) R224.2
NetJ1_D24: J1.D24 J1.VD24(D24) R234.2
NetJ1_D25: J1.D25 J1.VD25(D25) R244.2
NetJ1_D26: J1.D26 J1.VD26(D26) R254.2
NetJ1_D27: J1.D27 J1.VD27(D27) R264.2
NetJ1_D28: J1.D28 J1.VD28(D28) R274.2
NetJ1_D29: J1.D29 J1.VD29(D29) R284.2
NetJ1_D30: J1.D30 J1.VD30(D30) R294.2
NetJ1_E01: J1.E01 J1.VE01(E01) R5.1
NetJ1_E02: J1.E02 J1.VE02(E02) R15.1
NetJ1_E03: J1.E03 J1.VE03(E03) R25.1
NetJ1_E04: J1.E04 J1.VE04(E04) R35.1
NetJ1_E05: J1.E05 J1.VE05(E05) R45.1
NetJ1_E06: J1.E06 J1.VE06(E06) R55.1
NetJ1_E07: J1.E07 J1.VE07(E07) R65.1
NetJ1_E08: J1.E08 J1.VE08(E08) R75.1
NetJ1_E09: J1.E09 J1.VE09(E09) R85.1
NetJ1_E10: J1.E10 J1.VE10(E10) R95.1
NetJ1_E11: J1.E11 J1.VE11(E11) R105.1
NetJ1_E12: J1.E12 J1.VE12(E12) R115.1
NetJ1_E13: J1.E13 J1.VE13(E13) R125.1
NetJ1_E14: J1.E14 J1.VE14(E14) R135.1
NetJ1_E15: J1.E15 J1.VE15(E15) R145.1
NetJ1_E16: J1.E16 J1.VE16(E16) R155.1
NetJ1_E17: J1.E17 J1.VE17(E17) R165.1
NetJ1_E18: J1.E18 J1.VE18(E18) R175.1
NetJ1_E19: J1.E19 J1.VE19(E19) R185.1
NetJ1_E20: J1.E20 J1.VE20(E20) R195.1
NetJ1_E21: J1.E21 J1.VE21(E21) R205.1
NetJ1_E22: J1.E22 J1.VE22(E22) R215.1
NetJ1_E23: J1.E23 J1.VE23(E23) R225.1
NetJ1_E24: J1.E24 J1.VE24(E24) R235.1
NetJ1_E25: J1.E25 J1.VE25(E25) R245.1
NetJ1_E26: J1.E26 J1.VE26(E26) R255.1
NetJ1_E27: J1.E27 J1.VE27(E27) R265.1
NetJ1_E28: J1.E28 J1.VE28(E28) R275.1
NetJ1_E29: J1.E29 J1.VE29(E29) R285.1
NetJ1_E30: J1.E30 J1.VE30(E30) R295.1
NetJ1_F01: J1.F01 J1.VF01(F01) R6.2
NetJ1_F02: J1.F02 J1.VF02(F02) R16.2
NetJ1_F03: J1.F03 J1.VF03(F03) R26.2
NetJ1_F04: J1.F04 J1.VF04(F04) R36.2
NetJ1_F05: J1.F05 J1.VF05(F05) R46.2
NetJ1_F06: J1.F06 J1.VF06(F06) R56.2
NetJ1_F07: J1.F07 J1.VF07(F07) R66.2
NetJ1_F08: J1.F08 J1.VF08(F08) R76.2
NetJ1_F09: J1.F09 J1.VF09(F09) R86.2
NetJ1_F10: J1.F10 J1.VF10(F10) R96.2
NetJ1_F11: J1.F11 J1.VF11(F11) R106.2
NetJ1_F12: J1.F12 J1.VF12(F12) R116.2
NetJ1_F13: J1.F13 J1.VF13(F13) R126.2
NetJ1_F14: J1.F14 J1.VF14(F14) R136.2
NetJ1_F15: J1.F15 J1.VF15(F15) R146.2
NetJ1_F16: J1.F16 J1.VF16(F16) R156.2
NetJ1_F17: J1.F17 J1.VF17(F17) R166.2
NetJ1_F18: J1.F18 J1.VF18(F18) R176.2
NetJ1_F19: J1.F19 J1.VF19(F19) R186.2
NetJ1_F20: J1.F20 J1.VF20(F20) R196.2
NetJ1_F21: J1.F21 J1.VF21(F21) R206.2
NetJ1_F22: J1.F22 J1.VF22(F22) R216.2
NetJ1_F23: J1.F23 J1.VF23(F23) R226.2
NetJ1_F24: J1.F24 J1.VF24(F24) R236.2
NetJ1_F25: J1.F25 J1.VF25(F25) R246.2
NetJ1_F26: J1.F26 J1.VF26(F26) R256.2
NetJ1_F27: J1.F27 J1.VF27(F27) R266.2
NetJ1_F28: J1.F28 J1.VF28(F28) R276.2
NetJ1_F29: J1.F29 J1.VF29(F29) R286.2
NetJ1_F30: J1.F30 J1.VF30(F30) R296.2
NetJ1_G01: J1.G01 J1.VG01(G01) R7.1
NetJ1_G02: J1.G02 J1.VG02(G02) R17.1
NetJ1_G03: J1.G03 J1.VG03(G03) R27.1
NetJ1_G04: J1.G04 J1.VG04(G04) R37.1
NetJ1_G05: J1.G05 J1.VG05(G05) R47.1
NetJ1_G06: J1.G06 J1.VG06(G06) R57.1
NetJ1_G07: J1.G07 J1.VG07(G07) R67.1
NetJ1_G08: J1.G08 J1.VG08(G08) R77.1
NetJ1_G09: J1.G09 J1.VG09(G09) R87.1
NetJ1_G10: J1.G10 J1.VG10(G10) R97.1
NetJ1_G11: J1.G11 J1.VG11(G11) R107.1
NetJ1_G12: J1.G12 J1.VG12(G12) R117.1
NetJ1_G13: J1.G13 J1.VG13(G13) R127.1
NetJ1_G14: J1.G14 J1.VG14(G14) R137.1
NetJ1_G15: J1.G15 J1.VG15(G15) R147.1
NetJ1_G16: J1.G16 J1.VG16(G16) R157.1
NetJ1_G17: J1.G17 J1.VG17(G17) R167.1
NetJ1_G18: J1.G18 J1.VG18(G18) R177.1
NetJ1_G19: J1.G19 J1.VG19(G19) R187.1
NetJ1_G20: J1.G20 J1.VG20(G20) R197.1
NetJ1_G21: J1.G21 J1.VG21(G21) R207.1
NetJ1_G22: J1.G22 J1.VG22(G22) R217.1
NetJ1_G23: J1.G23 J1.VG23(G23) R227.1
NetJ1_G24: J1.G24 J1.VG24(G24) R237.1
NetJ1_G25: J1.G25 J1.VG25(G25) R247.1
NetJ1_G26: J1.G26 J1.VG26(G26) R257.1
NetJ1_G27: J1.G27 J1.VG27(G27) R267.1
NetJ1_G28: J1.G28 J1.VG28(G28) R277.1
NetJ1_G29: J1.G29 J1.VG29(G29) R287.1
NetJ1_G30: J1.G30 J1.VG30(G30) R297.1
NetJ1_H01: J1.H01 J1.VH01(H01) R8.2
NetJ1_H02: J1.H02 J1.VH02(H02) R18.2
NetJ1_H03: J1.H03 J1.VH03(H03) R28.2
NetJ1_H04: J1.H04 J1.VH04(H04) R38.2
NetJ1_H05: J1.H05 J1.VH05(H05) R48.2
NetJ1_H06: J1.H06 J1.VH06(H06) R58.2
NetJ1_H07: J1.H07 J1.VH07(H07) R68.2
NetJ1_H08: J1.H08 J1.VH08(H08) R78.2
NetJ1_H09: J1.H09 J1.VH09(H09) R88.2
NetJ1_H10: J1.H10 J1.VH10(H10) R98.2
NetJ1_H11: J1.H11 J1.VH11(H11) R108.2
NetJ1_H12: J1.H12 J1.VH12(H12) R118.2
NetJ1_H13: J1.H13 J1.VH13(H13) R128.2
NetJ1_H14: J1.H14 J1.VH14(H14) R138.2
NetJ1_H15: J1.H15 J1.VH15(H15) R148.2
NetJ1_H16: J1.H16 J1.VH16(H16) R158.2
NetJ1_H17: J1.H17 J1.VH17(H17) R168.2
NetJ1_H18: J1.H18 J1.VH18(H18) R178.2
NetJ1_H19: J1.H19 J1.VH19(H19) R188.2
NetJ1_H20: J1.H20 J1.VH20(H20) R198.2
NetJ1_H21: J1.H21 J1.VH21(H21) R208.2
NetJ1_H22: J1.H22 J1.VH22(H22) R218.2
NetJ1_H23: J1.H23 J1.VH23(H23) R228.2
NetJ1_H24: J1.H24 J1.VH24(H24) R238.2
NetJ1_H25: J1.H25 J1.VH25(H25) R248.2
NetJ1_H26: J1.H26 J1.VH26(H26) R258.2
NetJ1_H27: J1.H27 J1.VH27(H27) R268.2
NetJ1_H28: J1.H28 J1.VH28(H28) R278.2
NetJ1_H29: J1.H29 J1.VH29(H29) R288.2
NetJ1_H30: J1.H30 J1.VH30(H30) R298.2
NetJ1_I01: J1.I01 J1.VI01(I01) R9.1
NetJ1_I02: J1.I02 J1.VI02(I02) R19.1
NetJ1_I03: J1.I03 J1.VI03(I03) R29.1
NetJ1_I04: J1.I04 J1.VI04(I04) R39.1
NetJ1_I05: J1.I05 J1.VI05(I05) R49.1
NetJ1_I06: J1.I06 J1.VI06(I06) R59.1
NetJ1_I07: J1.I07 J1.VI07(I07) R69.1
NetJ1_I08: J1.I08 J1.VI08(I08) R79.1
NetJ1_I09: J1.I09 J1.VI09(I09) R89.1
NetJ1_I10: J1.I10 J1.VI10(I10) R99.1
NetJ1_I11: J1.I11 J1.VI11(I11) R109.1
NetJ1_I12: J1.I12 J1.VI12(I12) R119.1
NetJ1_I13: J1.I13 J1.VI13(I13) R129.1
NetJ1_I14: J1.I14 J1.VI14(I14) R139.1
NetJ1_I15: J1.I15 J1.VI15(I15) R149.1
NetJ1_I16: J1.I16 J1.VI16(I16) R159.1
NetJ1_I17: J1.I17 J1.VI17(I17) R169.1
NetJ1_I18: J1.I18 J1.VI18(I18) R179.1
NetJ1_I19: J1.I19 J1.VI19(I19) R189.1
NetJ1_I20: J1.I20 J1.VI20(I20) R199.1
NetJ1_I21: J1.I21 J1.VI21(I21) R209.1
NetJ1_I22: J1.I22 J1.VI22(I22) R219.1
NetJ1_I23: J1.I23 J1.VI23(I23) R229.1
NetJ1_I24: J1.I24 J1.VI24(I24) R239.1
NetJ1_I25: J1.I25 J1.VI25(I25) R249.1
NetJ1_I26: J1.I26 J1.VI26(I26) R259.1
NetJ1_I27: J1.I27 J1.VI27(I27) R269.1
NetJ1_I28: J1.I28 J1.VI28(I28) R279.1
NetJ1_I29: J1.I29 J1.VI29(I29) R289.1
NetJ1_I30: J1.I30 J1.VI30(I30) R299.1
NetJ1_J01: J1.J01 J1.VJ01(J01) R10.2
NetJ1_J02: J1.J02 J1.VJ02(J02) R20.2
NetJ1_J03: J1.J03 J1.VJ03(J03) R30.2
NetJ1_J04: J1.J04 J1.VJ04(J04) R40.2
NetJ1_J05: J1.J05 J1.VJ05(J05) R50.2
NetJ1_J06: J1.J06 J1.VJ06(J06) R60.2
NetJ1_J07: J1.J07 J1.VJ07(J07) R70.2
NetJ1_J08: J1.J08 J1.VJ08(J08) R80.2
NetJ1_J09: J1.J09 J1.VJ09(J09) R90.2
NetJ1_J10: J1.J10 J1.VJ10(J10) R100.2
NetJ1_J11: J1.J11 J1.VJ11(J11) R110.2
NetJ1_J12: J1.J12 J1.VJ12(J12) R120.2
NetJ1_J13: J1.J13 J1.VJ13(J13) R130.2
NetJ1_J14: J1.J14 J1.VJ14(J14) R140.2
NetJ1_J15: J1.J15 J1.VJ15(J15) R150.2
NetJ1_J16: J1.J16 J1.VJ16(J16) R160.2
NetJ1_J17: J1.J17 J1.VJ17(J17) R170.2
NetJ1_J18: J1.J18 J1.VJ18(J18) R180.2
NetJ1_J19: J1.J19 J1.VJ19(J19) R190.2
NetJ1_J20: J1.J20 J1.VJ20(J20) R200.2
NetJ1_J21: J1.J21 J1.VJ21(J21) R210.2
NetJ1_J22: J1.J22 J1.VJ22(J22) R220.2
NetJ1_J23: J1.J23 J1.VJ23(J23) R230.2
NetJ1_J24: J1.J24 J1.VJ24(J24) R240.2
NetJ1_J25: J1.J25 J1.VJ25(J25) R250.2
NetJ1_J26: J1.J26 J1.VJ26(J26) R260.2
NetJ1_J27: J1.J27 J1.VJ27(J27) R270.2
NetJ1_J28: J1.J28 J1.VJ28(J28) R280.2
NetJ1_J29: J1.J29 J1.VJ29(J29) R290.2
NetJ1_J30: J1.J30 J1.VJ30(J30) R300.2

## Library data of the parts
J1 = GMI-30-2-1.27-G-10: Package: None; Price: None; Value: *; MP: GMI-30-2-1.27-G-10; Availability: Unavailable; MFR PN: GMI-30-2-1.27-G-10
R1-R300 = RCS040239K0FKED: RES 39K OHM 1% 1/3W 0402; Power: 1/3W; MFR PN: RCS040239K0FKED; Tolerance: 1%